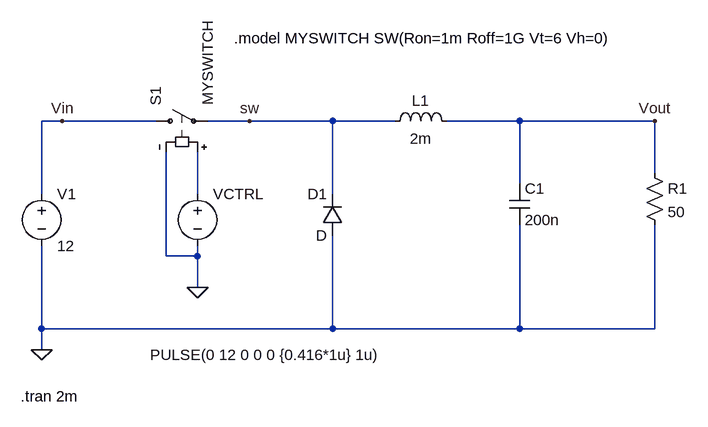
[diagram p0: schematic buck_converter_base.asc]
buck_converter_base.asc, the LTspice schematic file:
Version 4
SHEET 1 952 680
WIRE -16 48 -48 48
WIRE 128 48 -16 48
WIRE 272 48 208 48
WIRE 400 48 272 48
WIRE 496 48 400 48
WIRE 688 48 576 48
WIRE 896 48 688 48
WIRE 896 128 896 48
WIRE 688 144 688 48
WIRE -48 160 -48 48
WIRE 192 160 192 96
WIRE 400 160 400 48
WIRE 144 256 144 96
WIRE 192 256 192 240
WIRE 192 256 144 256
WIRE 192 304 192 256
WIRE -48 368 -48 240
WIRE 400 368 400 224
WIRE 400 368 -48 368
WIRE 688 368 688 208
WIRE 688 368 400 368
WIRE 896 368 896 208
WIRE 896 368 688 368
WIRE -48 400 -48 368
FLAG -48 400 0
FLAG 896 48 Vout
FLAG -16 48 Vin
FLAG 192 304 0
FLAG 272 48 sw
SYMBOL voltage -48 144 R0
WINDOW 123 0 0 Left 0
WINDOW 39 0 0 Left 0
SYMATTR InstName V1
SYMATTR Value 12
SYMBOL ind 480 64 R270
WINDOW 0 32 56 VTop 2
WINDOW 3 5 56 VBottom 2
SYMATTR InstName L1
SYMATTR Value 2m
SYMBOL cap 672 144 R0
SYMATTR InstName C1
SYMATTR Value 200n
SYMBOL res 880 112 R0
SYMATTR InstName R1
SYMATTR Value 50
SYMBOL sw 112 48 R270
SYMATTR InstName S1
SYMATTR Value MYSWITCH
SYMBOL voltage 192 144 R0
WINDOW 3 -73 264 Left 2
WINDOW 123 0 0 Left 0
WINDOW 39 0 0 Left 0
SYMATTR Value PULSE(0 12 0 0 0 {0.416*1u} 1u)
SYMATTR InstName VCTRL
SYMBOL diode 416 224 R180
WINDOW 0 24 64 Left 2
WINDOW 3 24 0 Left 2
SYMATTR InstName D1
TEXT -80 472 Left 2 !.tran 2m
TEXT 248 -80 Left 2 !.model MYSWITCH SW(Ron=1m Roff=1G Vt=6 Vh=0)

The netlist it stands for:
* buck_converter_base.asc
V1 Vin 0 12
L1 sw Vout 2m
C1 Vout 0 200n
R1 Vout 0 50
S1 Vin sw N001 0 MYSWITCH
VCTRL N001 0 PULSE(0 12 0 0 0 {0.416*1u} 1u)
D1 0 sw D
.model D D
.lib standard.dio
.tran 2m
.model MYSWITCH SW(Ron=1m Roff=1G Vt=6 Vh=0)
.backanno
.end